# EAGLE schematic gun_handle (EAGLE 9.2.0)
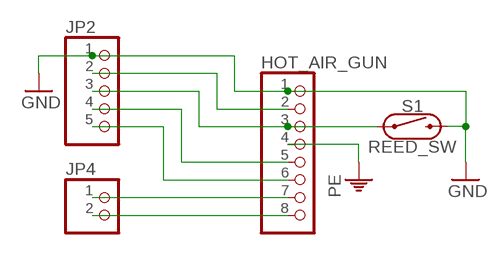
[diagram p0: schematic, sheet 1]

## Parts
HOT_AIR_GUN  PINHD-1X8  [1X08]
JP2  PINHD-1X5  [1X05]
JP4  PINHD-1X2  [1X02]
S1  REED_SW  REED_SWITCH-PTH-GLASS  [REED_SWITCH_GLASS]

## Nets
GND: HOT_AIR_GUN.1 JP2.1 S1.P$2
N$1: HOT_AIR_GUN.7 JP4.1
N$2: HOT_AIR_GUN.8 JP4.2
N$4: HOT_AIR_GUN.2 JP2.2
N$5: HOT_AIR_GUN.3 JP2.3 S1.P$1
N$6: HOT_AIR_GUN.5 JP2.4
N$7: HOT_AIR_GUN.6 JP2.5
PE: HOT_AIR_GUN.4

## Library data of the parts
HOT_AIR_GUN = pinhead:PINHD-1X8: PIN HEADER
JP2 = pinhead:PINHD-1X5: PIN HEADER
JP4 = pinhead:PINHD-1X2: PIN HEADER
S1 = SparkFun-Switches:REED_SWITCH: Reed Switch A reed switch is a magnetically-actuated switch. When the device is exposed to a magnetic field, the two ferrous materials inside the switch pull together and the switch closes. Variant Overview PTH-GLASS Reed Switch <https://www.sparkfun.com/products/8642> (COM-08642) - PTH reed switch w/ glass body (6.0 x 0.9 mm) PTH-INSULATED Reed Switch - Insulated <https://www.sparkfun.com/products/10601> (COM-10601) - PTH reed switch w/ insulated body (15.1 x 4.2 mm); PROD_ID: SWCH-09282; SF_SKU: COM-08642